# Altium project PCB.PrjPcb
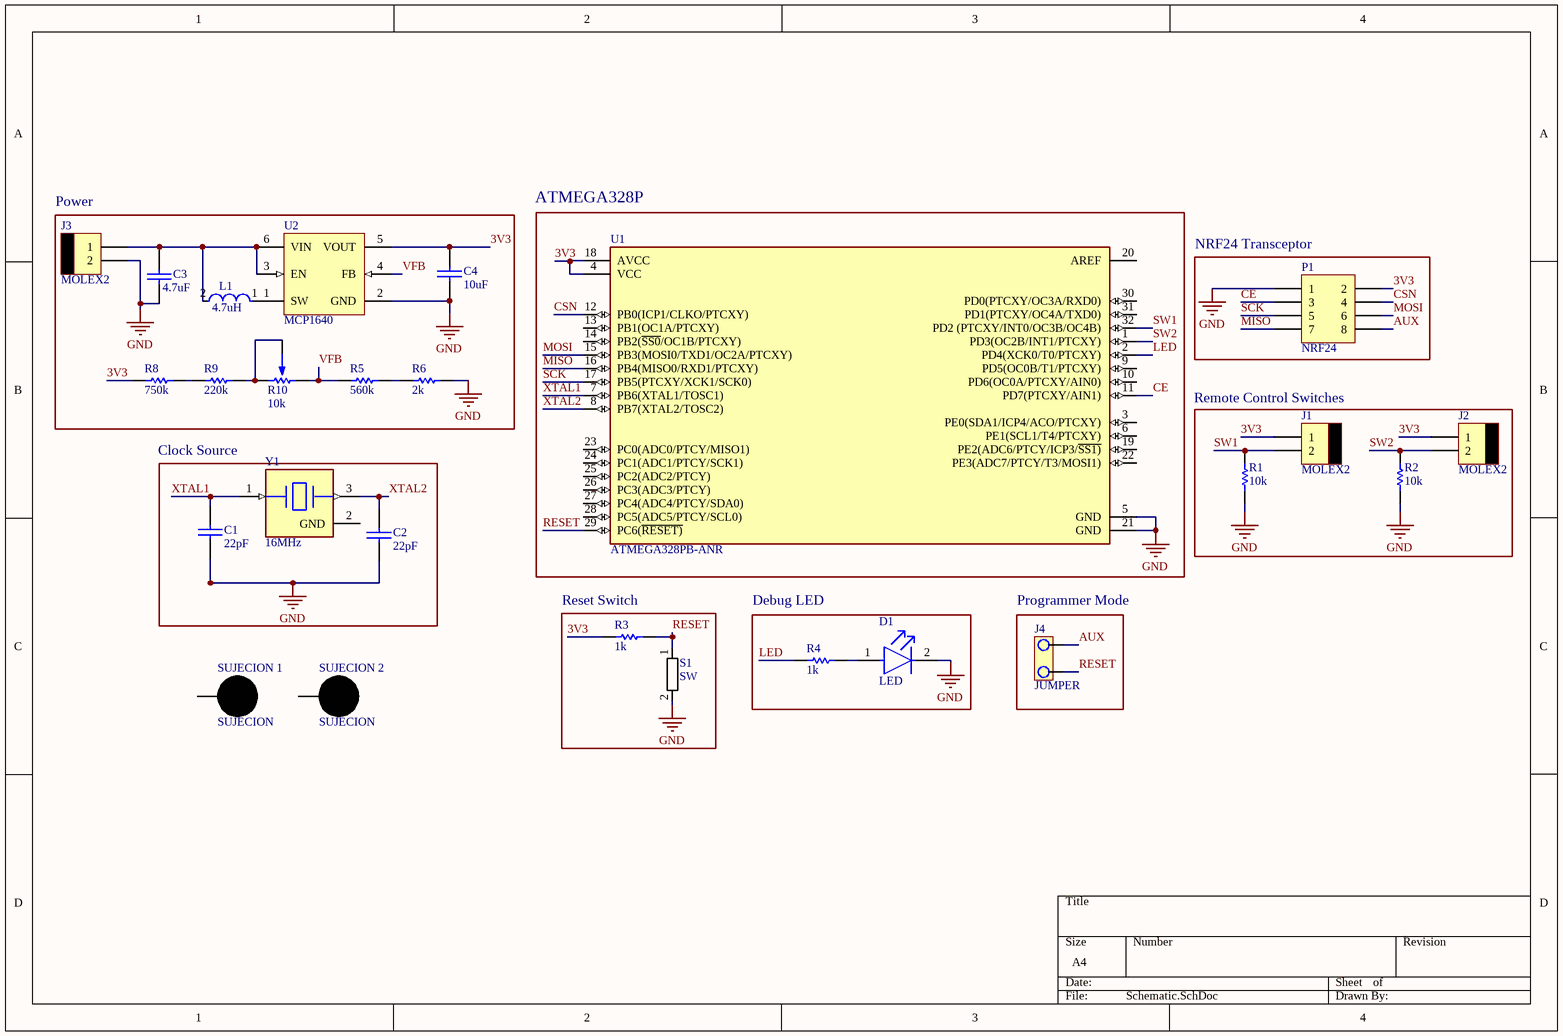
[diagram p0: Schematic.SchDoc]
1 sheet, 26 parts. Net scope: global (net labels, ports and power ports of the same name join across sheets).
Board file: PCB.PcbDoc

## Sheet Schematic.SchDoc
size A4; SheetNumber: 1; SheetTotal: 1; SPICEModelCacheCFXFRYDM: <root> / <DocumentId>CFXFRYDM</DocumentId> / </root>

### Parts
C1  22pF  [0805]
C2  22pF  [0805]
C3  4.7uF  [0805]
C4  10uF  [0805]
D1  LED  [FP-AP1608SGC-MFG]
J1  MOLEX2  [MOLEX2]
J2  MOLEX2  [MOLEX2]
J3  MOLEX2  [MOLEX2]
J4  JUMPER  [JUMPER2]
L1  4.7uH  [FP-CB2518-IPC_B]
P1  NRF24  [HDR2X4]
R1  10k  [0805]
R2  10k  [0805]
R3  1k  [0805]
R4  1k  [0805]
R5  560k  [0805]
R6  2k  [0805]
R8  750k  [0805]
R9  220k  [0805]
R10  10k  [PRESET V]
S1  SW  [PCBComponent_1]
SUJECION_1  SUJECION  [SUJECION (5.00MM - 3.50MM)]
SUJECION_2  SUJECION  [SUJECION (5.00MM - 3.50MM)]
U1  ATMEGA328PB-ANR  [FP-C04-074-MFG]
U2  MCP1640  [MCHP-SOT-23-CHY6_M]
Y1  16MHz  [FP-CSTNE16M0V530000R0-MFG]

### Blocks framed on the sheet
Power: C3 C4 J3 L1 R5 R6 R8-R10 U2
ATMEGA328P: U1
NRF24 Transceptor: P1
Remote Control Switches: J1 J2 R1 R2
Clock Source: C1 C2 Y1
Reset Switch: R3 S1
Debug LED: D1 R4
Programmer Mode: J4

### Nets
GND: C1.2 C2.2 C3.2 C4.2 D1.2(C) J3.2 P1.1 R1.1 R2.1 R6.2 S1.2 U1.5(GND) U1.21(GND) U2.2(GND)
3V3: C4.1 J1.1 J2.1 P1.2 R3.1 R8.1 U1.4(VCC) U1.18(AVCC) U2.5(VOUT)
AUX: J4.1 P1.8
CE: P1.3 U1.11(PD7(PTCXY/AIN1))
CSN: P1.4 U1.12(PB0(ICP1/CLKO/PTCXY))
LED: R4.1 U1.2(PD4(XCK0/T0/PTCXY))
MISO: P1.7 U1.16(PB4(MISO0/RXD1/PTCXY))
MOSI: P1.6 U1.15(PB3(MOSI0/TXD1/OC2A/PTCXY))
RESET: J4.2 R3.2 S1.1 U1.29(PC6(~{RESET)})
SCK: P1.5 U1.17(PB5(PTCXY/XCK1/SCK0))
SW1: J1.2 R1.2 U1.32(PD2_(PTCXY/INT0/OC3B/OC4B))
SW2: J2.2 R2.2 U1.1(PD3(OC2B/INT1/PTCXY))
VFB: R5.1 R10.3 U2.4(FB)
XTAL1: C1.1 U1.7(PB6(XTAL1/TOSC1)) Y1.1(Input)
XTAL2: C2.1 U1.8(PB7(XTAL2/TOSC2)) Y1.3(Output)
NetC3_1: C3.1 J3.1 L1.2 U2.3(EN) U2.6(VIN)
NetD1_1: D1.1(A) R4.2
NetL1_1: L1.1 U2.1(SW)
NetR5_2: R5.2 R6.1
NetR8_2: R8.2 R9.1
NetR9_2: R9.2 R10.1 R10.2

Not connected (* = marked no-connect by the designer): SUJECION_1 1; SUJECION_2 1; U1 3(PE0(SDA1/ICP4/ACO/PTCXY)) 6(PE1(SCL1/T4/PTCXY)) 9(PD5(OC0B/T1/PTCXY)) 10(PD6(OC0A/PTCXY/AIN0)) 13(PB1(OC1A/PTCXY)) 14(PB2(~{SS0}/OC1B/PTCXY)) 19(PE2(ADC6/PTCY/ICP3/~{SS1)}) 20(AREF) 22(PE3(ADC7/PTCY/T3/MOSI1)) 23(PC0(ADC0/PTCY/MISO1)) 24(PC1(ADC1/PTCY/SCK1)) 25(PC2(ADC2/PTCY)) 26(PC3(ADC3/PTCY)) 27(PC4(ADC4/PTCY/SDA0)) 28(PC5(ADC5/PTCY/SCL0)) 30(PD0(PTCXY/OC3A/RXD0)) 31(PD1(PTCXY/OC4A/TXD0)); Y1 2(GND)

### Library data of the parts
C1-C4 = CAP
D1 = CMP-44529-000023-1: Standard LEDs - SMD GREEN WATER CLEAR; Luminous Intensity: 15mcd; Wavelength: 568nm; Forward Voltage: 2.2V; Forward Current: 20mA; Viewing Angle: 120°; Min Operating Temperature: -40°C; Mount: Surface Mount; Case/Package: 0603; Package Quantity: 2000; Lens Style: Clear; Illumination Color: Green; Packaging: Tape and Reel; Color: Green; Lead Free: Lead Free; Lens Color: Clear; Max Operating Temperature: 85°C
L1 = CMP-14484-000470-1: SMD Inductors 4.7uH ±20% 1.2A 0.13Ω 1007; Shielding: Unshielded; Self Resonant Frequency: 46MHz; Saturation Current: 310mA; Core Material: Ferrite; DC Resistance (DCR): 130mR; Test Frequency: 7.96MHz; Inductance Tolerance: 20%; Min Operating Temperature: -40°C; Series: CB; Depth: 2mm; Height - Seated (Max): 0.079inch; Radiation Hardening: No; Current Rating: 1.2A; Halogen Free: Halogen Free; Height: 1.8mm; RoHS Compliant: Yes; Inductance: 4.7uH; Length: 0.098inch; Packaging: Tape and Reel; Package Quantity: 2000; Termination: SMD/SMT; Resistor Type: Wirewound; Case Code (Metric): 2518; Tolerance: 20%; Case Code (Imperial): 1007; Case/Package: 1007; Max DC Current: 1.2A; Width: 0.071inch; Max Operating Temperature: 105°C; Lead Free: Lead Free; Mount: Surface Mount
P1 = Header 4X2: Header, 4-Pin, Dual row; LatestRevisionDate: 17-Jul-2002; LatestRevisionNote: Re-released for DXP Platform.; Publisher: Altium Limited
R1-R6 R8 R9 = RES
R10 = PRESET
S1 = Nano RST SW: Nano Reset SMD Switch
U1 = CMP-06276-000131-1: IC MCU 8BIT 32KB FLASH 32TQFP; RoHS Compliant: Yes
U2 = CMP-0139-00284-1: Start-up Synchronous Boost Regulator with True Output Disconnect or Input / Output Bypass Option, 350 mA, Input Voltage 0.65 to 5.5 V, Output Voltage 2.0 to 5.5 V, -40 to 85 degC, 6-pin SOT-23 (CHY6), Tape and Reel; Manufacturer: Microchip; PartNumber: MCP1640CT-I/CHY; ComponentLink2URL: http://ww1.microchip.com/downloads/en/DeviceDoc/22234B.pdf; ComponentLink4URL: http://www.microchip.com/MCP1640; ComponentLink4Description: Product URL; ComponentLink3URL: http://www.microchip.com/stellent/groups/techpub_sg/documents/packagingspec/en012702.pdf; PackageReference: SOT-23-CHY6; ComponentLink2Description: Datasheet; PackageDescription: 6-Lead Plastic Small Outline Transistor, 2.9 x 1.55 mm Body, 0.95 mm Pitch; PackageVersion: C04-028B; ComponentLink1Description: Manufacturer URL; ComponentLink1URL: http://www.microchip.com; DatasheetVersion: Rev. B; Mounting Technology: Surface Mount; ComponentLink3Description: Package Specification
Y1 = CMP-06054-000001-1: CERAMIC RES 16.0000MHZ 15PF SMD; Manufacturer Part Number: CSTNE16M0V530000R0; Manufacturer: Murata; Tolerance: 0.5%; Stability: 0.3%; Description: 16MHz Ceramic Resonator Built in Capacitor 15pF ±0.3% 40 Ohms -40°C ~ 85°C Surface Mount; Esr: 40Ω; Lead Free: Yes; ComponentLink2URL: https://www.murata.com/en-sg/products/productdata/8801162231838/SPEC-CSTNE16M0V530000R0.pdf?1545967809000; ComponentLink2Description: Datasheet; Device Class L3: Crystals; Load Capacitance: 15pF; Temperature: -40°C to +85°C; Temperature Range High: +85°C; Series: CSTNE_V; Mouser Description: Ceramic Resonator 16MHz ±0.5% (Tol) ±0.3% (Stability) 15pF 40Ohm 3-Pin CSMD T/R; Automotive: No; RoHS: TRUE; Device Class L2: Crystals / Oscillators; Frequency: 16MHz; Package: 0; Category: Crys; Device Class L1: Passive Components; Height: 1mm; Temperature Range Low: -40°C; Digikey Description: CERAMIC RES 16.0000MHZ 15PF SMD; Octopart: https://octopart.com/cstne16m0v530000r0-murata-91406924